# Altium schematic sheet matrix.SchDoc
size 1270 x 241 mm
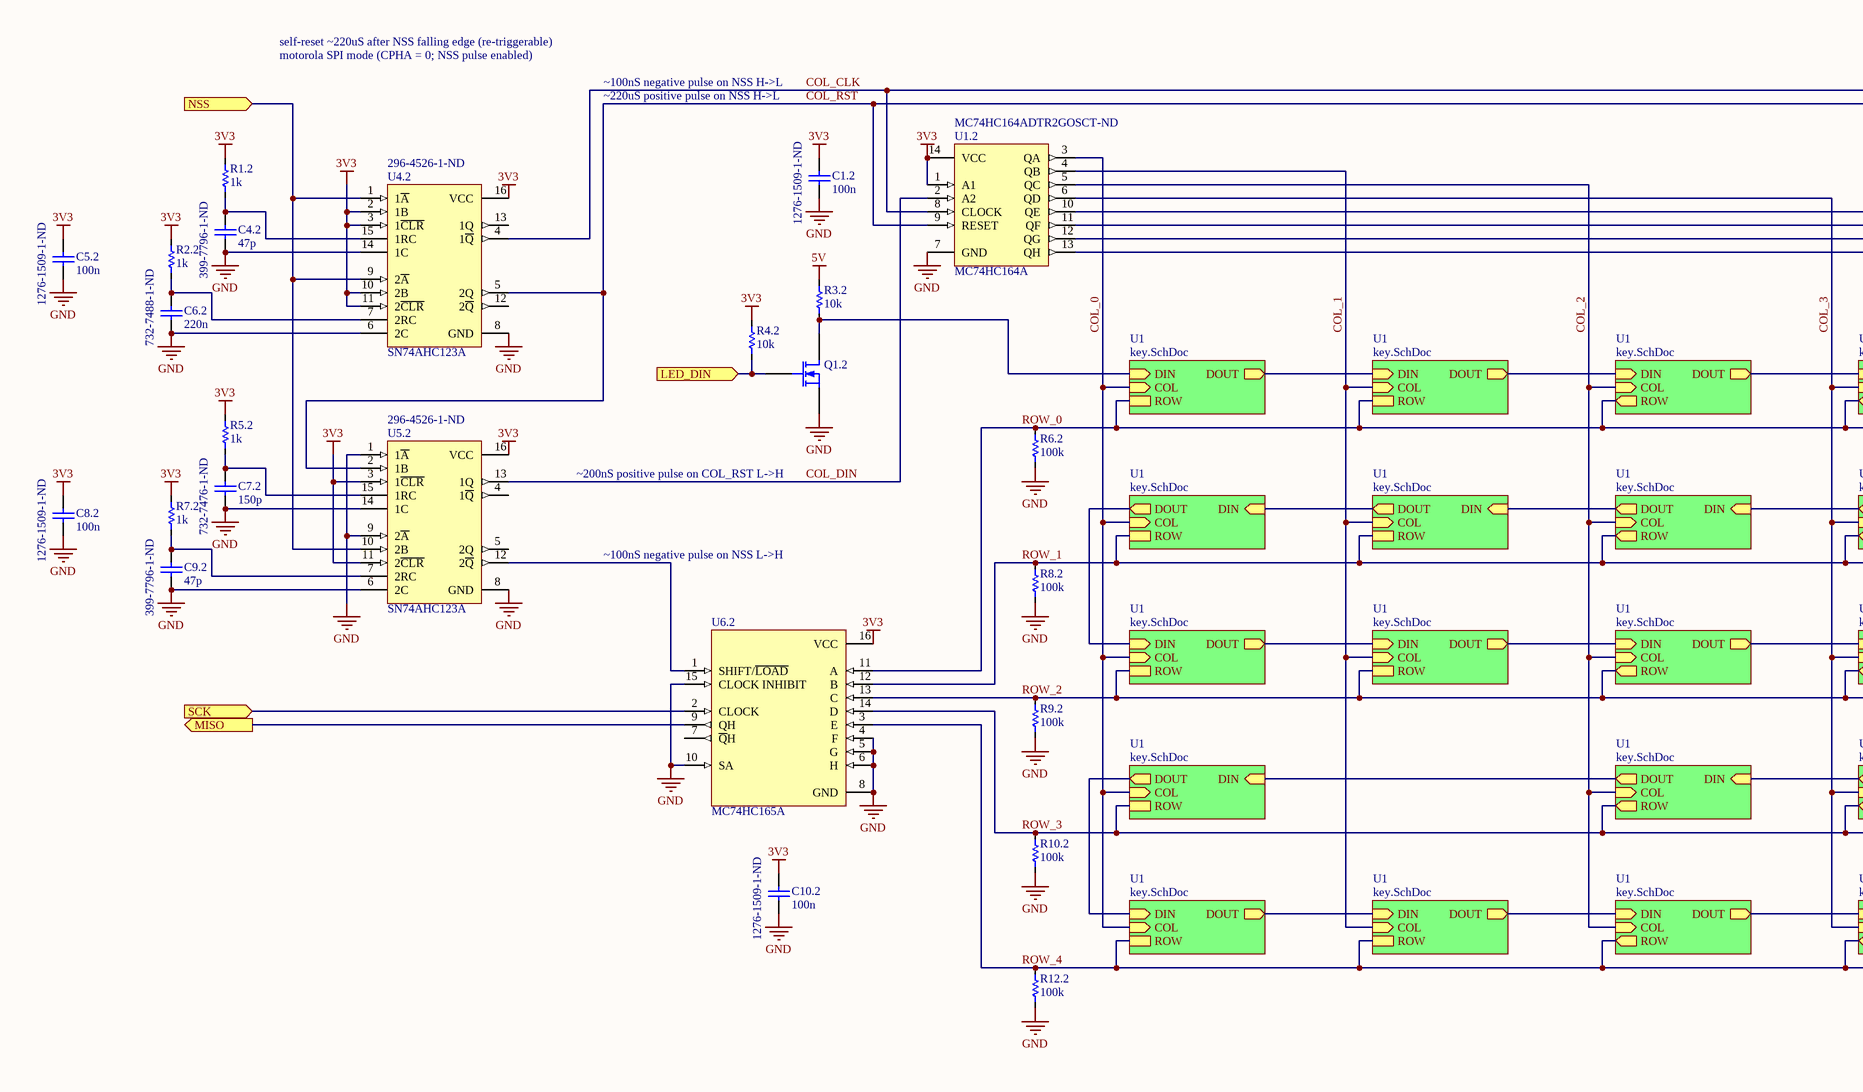
[diagram p0: matrix.SchDoc, left]
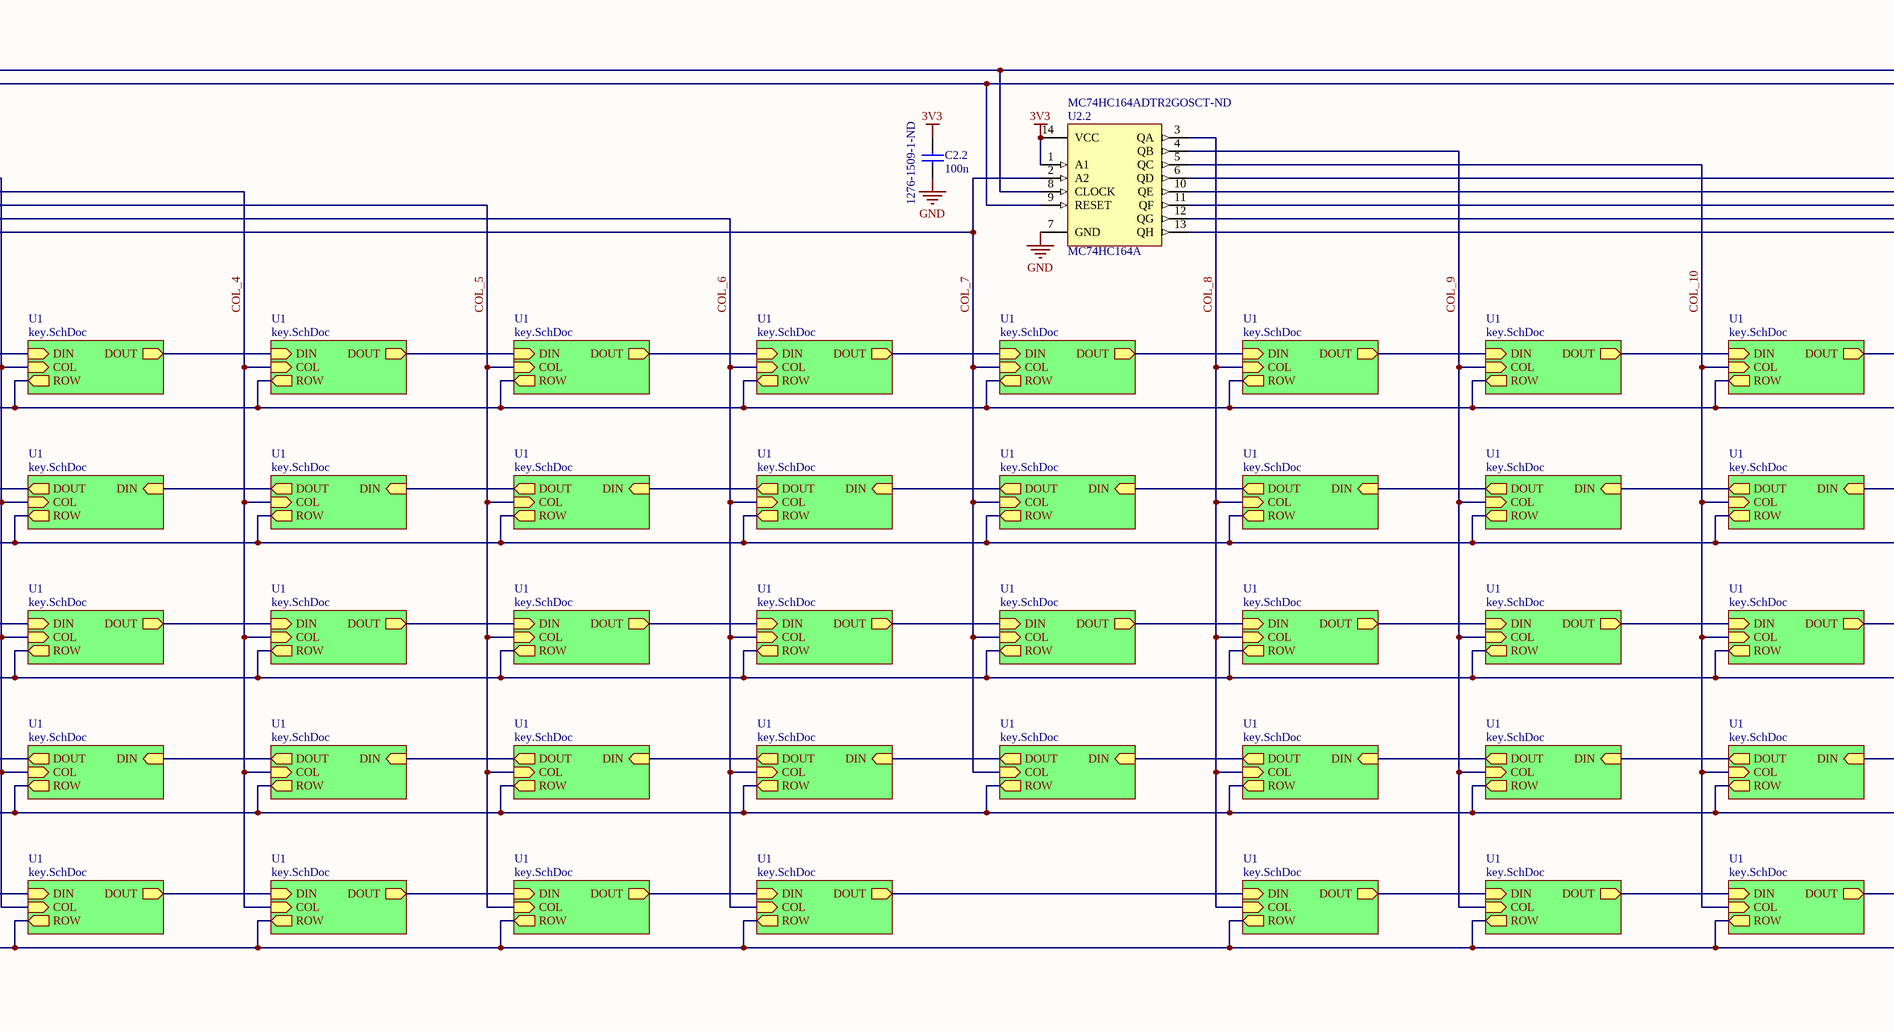
[diagram p1: matrix.SchDoc, middle]
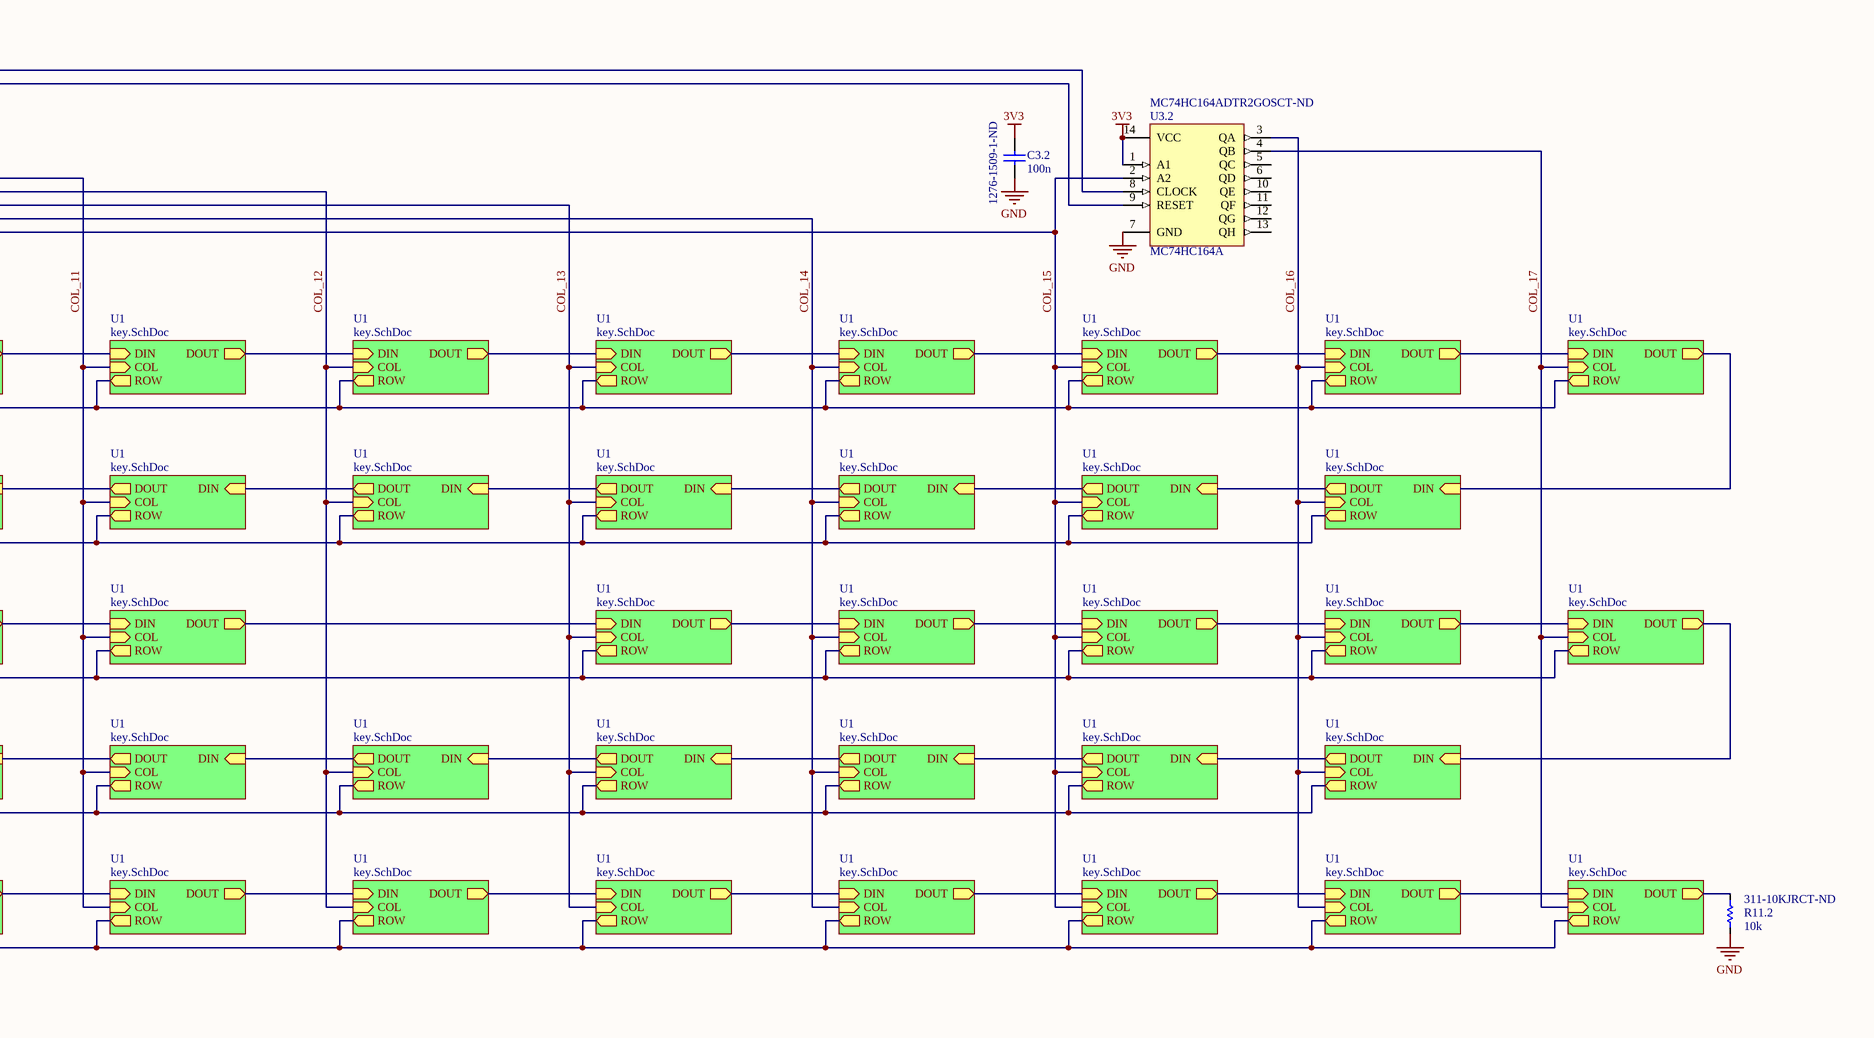
[diagram p2: matrix.SchDoc, right]

## Parts
C1.2  Supplier Part Number 1: 1276-1509-1-ND  [0402]  (hidden comment: 100n)
C2.2  Supplier Part Number 1: 1276-1509-1-ND  [0402]  (hidden comment: 100n)
C3.2  Supplier Part Number 1: 1276-1509-1-ND  [0402]  (hidden comment: 100n)
C4.2  Supplier Part Number 1: 399-7796-1-ND  [0402]  (hidden comment: 47p)
C5.2  Supplier Part Number 1: 1276-1509-1-ND  [0402]  (hidden comment: 100n)
C6.2  Supplier Part Number 1: 732-7488-1-ND  [0402]  (hidden comment: 220n)
C7.2  Supplier Part Number 1: 732-7476-1-ND  [0402]  (hidden comment: 150p)
C8.2  Supplier Part Number 1: 1276-1509-1-ND  [0402]  (hidden comment: 100n)
C9.2  Supplier Part Number 1: 399-7796-1-ND  [0402]  (hidden comment: 47p)
C10.2  Supplier Part Number 1: 1276-1509-1-ND  [0402]  (hidden comment: 100n)
Q1.2  2N7002  [SOT23]  (value not drawn)
R1.2  1k  [0402]
R2.2  1k  [0402]
R3.2  10k  [0402]
R4.2  10k  [0402]
R5.2  1k  [0402]
R6.2  100k  [0402]
R7.2  1k  [0402]
R8.2  100k  [0402]
R9.2  100k  [0402]
R10.2  100k  [0402]
R11.2  Supplier Part Number 1: 311-10KJRCT-ND  [0402]  (hidden comment: 10k)
R12.2  100k  [0402]
U1.2  MC74HC164A  Supplier Part Number 1: MC74HC164ADTR2GOSCT-ND  [TSOP65P640X120-14N]
U2.2  MC74HC164A  Supplier Part Number 1: MC74HC164ADTR2GOSCT-ND  [TSOP65P640X120-14N]
U3.2  MC74HC164A  Supplier Part Number 1: MC74HC164ADTR2GOSCT-ND  [TSOP65P640X120-14N]
U4.2  SN74AHC123A  Supplier Part Number 1: 296-4526-1-ND  [TSSOP16_N]
U5.2  SN74AHC123A  Supplier Part Number 1: 296-4526-1-ND  [TSSOP16_N]
U6.2  MC74HC165A  [TSSOP16_N]

## Sub-sheets
U1 = key.SchDoc: COL (in), ROW, DOUT (out), DIN (in)
U1 = key.SchDoc: COL (in), ROW, DOUT (out), DIN (in)
U1 = key.SchDoc: COL (in), ROW (out), DOUT (out), DIN (in)
U1 = key.SchDoc: COL (in), ROW (out), DOUT (out), DIN (in)
U1 = key.SchDoc: COL (in), ROW (out), DOUT (out), DIN (in)
U1 = key.SchDoc: COL (in), ROW (out), DOUT (out), DIN (in)
U1 = key.SchDoc: COL (in), ROW (out), DOUT (out), DIN (in)
U1 = key.SchDoc: COL (in), ROW (out), DOUT (out), DIN (in)
U1 = key.SchDoc: COL (in), ROW (out), DOUT (out), DIN (in)
U1 = key.SchDoc: COL (in), ROW (out), DOUT (out), DIN (in)
U1 = key.SchDoc: COL (in), ROW (out), DOUT (out), DIN (in)
U1 = key.SchDoc: COL (in), ROW (out), DOUT (out), DIN (in)
U1 = key.SchDoc: COL (in), ROW (out), DOUT (out), DIN (in)
U1 = key.SchDoc: COL (in), ROW (out), DOUT (out), DIN (in)
U1 = key.SchDoc: COL (in), ROW (out), DOUT (out), DIN (in)
U1 = key.SchDoc: COL (in), ROW (out), DOUT (out), DIN (in)
U1 = key.SchDoc: COL (in), ROW (out), DOUT (out), DIN (in)
U1 = key.SchDoc: COL (in), ROW (out), DOUT (out), DIN (in)
U1 = key.SchDoc: COL (in), ROW, DOUT (out), DIN (in)
U1 = key.SchDoc: COL (in), ROW, DOUT (out), DIN (in)
U1 = key.SchDoc: COL (in), ROW (out), DOUT (out), DIN (in)
U1 = key.SchDoc: COL (in), ROW (out), DOUT (out), DIN (in)
U1 = key.SchDoc: COL (in), ROW (out), DOUT (out), DIN (in)
U1 = key.SchDoc: COL (in), ROW (out), DOUT (out), DIN (in)
U1 = key.SchDoc: COL (in), ROW (out), DOUT (out), DIN (in)
U1 = key.SchDoc: COL (in), ROW (out), DOUT (out), DIN (in)
U1 = key.SchDoc: COL (in), ROW (out), DOUT (out), DIN (in)
U1 = key.SchDoc: COL (in), ROW (out), DOUT (out), DIN (in)
U1 = key.SchDoc: COL (in), ROW (out), DOUT (out), DIN (in)
U1 = key.SchDoc: COL (in), ROW (out), DOUT (out), DIN (in)
U1 = key.SchDoc: COL (in), ROW (out), DOUT (out), DIN (in)
U1 = key.SchDoc: COL (in), ROW (out), DOUT (out), DIN (in)
U1 = key.SchDoc: COL (in), ROW, DOUT (out), DIN (in)
U1 = key.SchDoc: COL (in), ROW, DOUT (out), DIN (in)
U1 = key.SchDoc: COL (in), ROW (out), DOUT (out), DIN (in)
U1 = key.SchDoc: COL (in), ROW (out), DOUT (out), DIN (in)
U1 = key.SchDoc: COL (in), ROW (out), DOUT (out), DIN (in)
U1 = key.SchDoc: COL (in), ROW (out), DOUT (out), DIN (in)
U1 = key.SchDoc: COL (in), ROW (out), DOUT (out), DIN (in)
U1 = key.SchDoc: COL (in), ROW (out), DOUT (out), DIN (in)
U1 = key.SchDoc: COL (in), ROW (out), DOUT (out), DIN (in)
U1 = key.SchDoc: COL (in), ROW (out), DOUT (out), DIN (in)
U1 = key.SchDoc: COL (in), ROW (out), DOUT (out), DIN (in)
U1 = key.SchDoc: COL (in), ROW (out), DOUT (out), DIN (in)
U1 = key.SchDoc: COL (in), ROW (out), DOUT (out), DIN (in)
U1 = key.SchDoc: COL (in), ROW, DOUT (out), DIN (in)
U1 = key.SchDoc: COL (in), ROW (out), DOUT (out), DIN (in)
U1 = key.SchDoc: COL (in), ROW (out), DOUT (out), DIN (in)
U1 = key.SchDoc: COL (in), ROW (out), DOUT (out), DIN (in)
U1 = key.SchDoc: COL (in), ROW (out), DOUT (out), DIN (in)
U1 = key.SchDoc: COL (in), ROW (out), DOUT (out), DIN (in)
U1 = key.SchDoc: COL (in), ROW (out), DOUT (out), DIN (in)
U1 = key.SchDoc: COL (in), ROW (out), DOUT (out), DIN (in)
U1 = key.SchDoc: COL (in), ROW (out), DOUT (out), DIN (in)
U1 = key.SchDoc: COL (in), ROW (out), DOUT (out), DIN (in)
U1 = key.SchDoc: COL (in), ROW (out), DOUT (out), DIN (in)
U1 = key.SchDoc: COL (in), ROW (out), DOUT (out), DIN (in)
U1 = key.SchDoc: COL (in), ROW, DOUT (out), DIN (in)
U1 = key.SchDoc: COL (in), ROW, DOUT (out), DIN (in)
U1 = key.SchDoc: COL (in), ROW (out), DOUT (out), DIN (in)
U1 = key.SchDoc: COL (in), ROW (out), DOUT (out), DIN (in)
U1 = key.SchDoc: COL (in), ROW (out), DOUT (out), DIN (in)
U1 = key.SchDoc: COL (in), ROW (out), DOUT (out), DIN (in)
U1 = key.SchDoc: COL (in), ROW (out), DOUT (out), DIN (in)
U1 = key.SchDoc: COL (in), ROW (out), DOUT (out), DIN (in)
U1 = key.SchDoc: COL (in), ROW (out), DOUT (out), DIN (in)
U1 = key.SchDoc: COL (in), ROW (out), DOUT (out), DIN (in)
U1 = key.SchDoc: COL (in), ROW (out), DOUT (out), DIN (in)
U1 = key.SchDoc: COL (in), ROW (out), DOUT (out), DIN (in)
U1 = key.SchDoc: COL (in), ROW (out), DOUT (out), DIN (in)
U1 = key.SchDoc: COL (in), ROW (out), DOUT (out), DIN (in)
U1 = key.SchDoc: COL (in), ROW (out), DOUT (out), DIN (in)
U1 = key.SchDoc: COL (in), ROW (out), DOUT (out), DIN (in)
U1 = key.SchDoc: COL (in), ROW (out), DOUT (out), DIN (in)
U1 = key.SchDoc: COL (in), ROW (out), DOUT (out), DIN (in)
U1 = key.SchDoc: COL (in), ROW (out), DOUT (out), DIN (in)
U1 = key.SchDoc: COL (in), ROW (out), DOUT (out), DIN (in)
U1 = key.SchDoc: COL (in), ROW (out), DOUT (out), DIN (in)
U1 = key.SchDoc: COL (in), ROW (out), DOUT (out), DIN (in)
U1 = key.SchDoc: COL (in), ROW (out), DOUT (out), DIN (in)
U1 = key.SchDoc: COL (in), ROW (out), DOUT (out), DIN (in)
U1 = key.SchDoc: COL (in), ROW (out), DOUT (out), DIN (in)
U1 = key.SchDoc: COL (in), ROW (out), DOUT (out), DIN (in)
U1 = key.SchDoc: COL (in), ROW (out), DOUT (out), DIN (in)
U1 = key.SchDoc: COL (in), ROW (out), DOUT (out), DIN (in)

## Ports
LED_DIN (in), MISO (out), NSS (in), SCK (in)

## Nets
3V3: C1.2.1 C2.2.1 C3.2.1 C5.2.1 C8.2.1 C10.2.1 R1.2.2 R2.2.2 R4.2.2 R5.2.2 R7.2.2 U1.2.1(A1) U1.2.14(VCC) U2.2.1(A1) U2.2.14(VCC) U3.2.1(A1) U3.2.14(VCC) U4.2.2(1B) U4.2.3(1~{CLR}) U4.2.10(2B) U4.2.11(2~{CLR}) U4.2.16(VCC) U5.2.3(1~{CLR}) U5.2.11(2~{CLR}) U5.2.16(VCC) U6.2.16(VCC)
5V: R3.2.2
GND: C1.2.2 C2.2.2 C3.2.2 C4.2.1 C5.2.2 C6.2.2 C7.2.1 C8.2.2 C9.2.1 C10.2.2 Q1.2.2(S) R6.2.1 R8.2.1 R9.2.1 R10.2.1 R11.2.1 R12.2.1 U1.2.7(GND) U2.2.7(GND) U3.2.7(GND) U4.2.6(2C) U4.2.8(GND) U4.2.14(1C) U5.2.1(1~{A}) U5.2.6(2C) U5.2.8(GND) U5.2.9(2~{A}) U5.2.14(1C) U6.2.4(F) U6.2.5(G) U6.2.6(H) U6.2.8(GND) U6.2.10(SA) U6.2.15(CLOCK_INHIBIT)
COL_0: U1.2.3(QA) ; sheet U1/COL, sheet U1/COL, sheet U1/COL, sheet U1/COL, sheet U1/COL
COL_1: U1.2.4(QB) ; sheet U1/COL, sheet U1/COL, sheet U1/COL, sheet U1/COL
COL_2: U1.2.5(QC) ; sheet U1/COL, sheet U1/COL, sheet U1/COL, sheet U1/COL, sheet U1/COL
COL_3: U1.2.6(QD) ; sheet U1/COL, sheet U1/COL, sheet U1/COL, sheet U1/COL, sheet U1/COL
COL_4: U1.2.10(QE) ; sheet U1/COL, sheet U1/COL, sheet U1/COL, sheet U1/COL, sheet U1/COL
COL_5: U1.2.11(QF) ; sheet U1/COL, sheet U1/COL, sheet U1/COL, sheet U1/COL, sheet U1/COL
COL_6: U1.2.12(QG) ; sheet U1/COL, sheet U1/COL, sheet U1/COL, sheet U1/COL, sheet U1/COL
COL_7: U1.2.13(QH) U2.2.2(A2) ; sheet U1/COL, sheet U1/COL, sheet U1/COL, sheet U1/COL
COL_8: U2.2.3(QA) ; sheet U1/COL, sheet U1/COL, sheet U1/COL, sheet U1/COL, sheet U1/COL
COL_9: U2.2.4(QB) ; sheet U1/COL, sheet U1/COL, sheet U1/COL, sheet U1/COL, sheet U1/COL
COL_10: U2.2.5(QC) ; sheet U1/COL, sheet U1/COL, sheet U1/COL, sheet U1/COL, sheet U1/COL
COL_11: U2.2.6(QD) ; sheet U1/COL, sheet U1/COL, sheet U1/COL, sheet U1/COL, sheet U1/COL
COL_12: U2.2.10(QE) ; sheet U1/COL, sheet U1/COL, sheet U1/COL, sheet U1/COL
COL_13: U2.2.11(QF) ; sheet U1/COL, sheet U1/COL, sheet U1/COL, sheet U1/COL, sheet U1/COL
COL_14: U2.2.12(QG) ; sheet U1/COL, sheet U1/COL, sheet U1/COL, sheet U1/COL, sheet U1/COL
COL_15: U2.2.13(QH) U3.2.2(A2) ; sheet U1/COL, sheet U1/COL, sheet U1/COL, sheet U1/COL, sheet U1/COL
COL_16: U3.2.3(QA) ; sheet U1/COL, sheet U1/COL, sheet U1/COL, sheet U1/COL, sheet U1/COL
COL_17: U3.2.4(QB) ; sheet U1/COL, sheet U1/COL, sheet U1/COL
COL_CLK: U1.2.8(CLOCK) U2.2.8(CLOCK) U3.2.8(CLOCK) U4.2.4(1~{Q})
COL_DIN: U1.2.2(A2) U5.2.13(1Q)
COL_RST: U1.2.9(RESET) U2.2.9(RESET) U3.2.9(RESET) U4.2.5(2Q) U5.2.2(1B)
LED_DIN: Q1.2.3(G) R4.2.1 ; port LED_DIN
MISO: U6.2.9(QH) ; port MISO
NSS: U4.2.1(1~{A}) U4.2.9(2~{A}) U5.2.10(2B) ; port NSS
ROW_0: R6.2.2 U6.2.11(A) ; sheet U1/ROW, sheet U1/ROW, sheet U1/ROW, sheet U1/ROW, sheet U1/ROW, sheet U1/ROW, sheet U1/ROW, sheet U1/ROW, sheet U1/ROW, sheet U1/ROW, sheet U1/ROW, sheet U1/ROW, sheet U1/ROW, sheet U1/ROW, sheet U1/ROW, sheet U1/ROW, sheet U1/ROW, sheet U1/ROW
ROW_1: R8.2.2 U6.2.12(B) ; sheet U1/ROW, sheet U1/ROW, sheet U1/ROW, sheet U1/ROW, sheet U1/ROW, sheet U1/ROW, sheet U1/ROW, sheet U1/ROW, sheet U1/ROW, sheet U1/ROW, sheet U1/ROW, sheet U1/ROW, sheet U1/ROW, sheet U1/ROW, sheet U1/ROW, sheet U1/ROW, sheet U1/ROW
ROW_2: R9.2.2 U6.2.13(C) ; sheet U1/ROW, sheet U1/ROW, sheet U1/ROW, sheet U1/ROW, sheet U1/ROW, sheet U1/ROW, sheet U1/ROW, sheet U1/ROW, sheet U1/ROW, sheet U1/ROW, sheet U1/ROW, sheet U1/ROW, sheet U1/ROW, sheet U1/ROW, sheet U1/ROW, sheet U1/ROW, sheet U1/ROW
ROW_3: R10.2.2 U6.2.14(D) ; sheet U1/ROW, sheet U1/ROW, sheet U1/ROW, sheet U1/ROW, sheet U1/ROW, sheet U1/ROW, sheet U1/ROW, sheet U1/ROW, sheet U1/ROW, sheet U1/ROW, sheet U1/ROW, sheet U1/ROW, sheet U1/ROW, sheet U1/ROW, sheet U1/ROW, sheet U1/ROW
ROW_4: R12.2.2 U6.2.3(E) ; sheet U1/ROW, sheet U1/ROW, sheet U1/ROW, sheet U1/ROW, sheet U1/ROW, sheet U1/ROW, sheet U1/ROW, sheet U1/ROW, sheet U1/ROW, sheet U1/ROW, sheet U1/ROW, sheet U1/ROW, sheet U1/ROW, sheet U1/ROW, sheet U1/ROW, sheet U1/ROW, sheet U1/ROW
SCK: U6.2.2(CLOCK) ; port SCK
NetC4.2_2: C4.2.2 R1.2.1 U4.2.15(1RC)
NetC6.2_1: C6.2.1 R2.2.1 U4.2.7(2RC)
NetC7.2_2: C7.2.2 R5.2.1 U5.2.15(1RC)
NetC9.2_2: C9.2.2 R7.2.1 U5.2.7(2RC)
NetQ1.2_1: Q1.2.1(D) R3.2.1 ; sheet U1/DIN
NetR11.2_2: R11.2.2 ; sheet U1/DOUT
NetU5.2_12: U5.2.12(2~{Q}) U6.2.1(SHIFT/~{LOAD})
(unnamed): sheet U1/DOUT, sheet U1/DIN
(unnamed): sheet U1/DOUT, sheet U1/DIN
(unnamed): sheet U1/DOUT, sheet U1/DIN
(unnamed): sheet U1/DOUT, sheet U1/DIN
(unnamed): sheet U1/DOUT, sheet U1/DIN
(unnamed): sheet U1/DOUT, sheet U1/DIN
(unnamed): sheet U1/DOUT, sheet U1/DIN
(unnamed): sheet U1/DOUT, sheet U1/DIN
(unnamed): sheet U1/DOUT, sheet U1/DIN
(unnamed): sheet U1/DOUT, sheet U1/DIN
(unnamed): sheet U1/DOUT, sheet U1/DIN
(unnamed): sheet U1/DOUT, sheet U1/DIN
(unnamed): sheet U1/DOUT, sheet U1/DIN
(unnamed): sheet U1/DOUT, sheet U1/DIN
(unnamed): sheet U1/DOUT, sheet U1/DIN
(unnamed): sheet U1/DOUT, sheet U1/DIN
(unnamed): sheet U1/DOUT, sheet U1/DIN
(unnamed): sheet U1/DOUT, sheet U1/DIN
(unnamed): sheet U1/DOUT, sheet U1/DIN
(unnamed): sheet U1/DIN, sheet U1/DOUT
(unnamed): sheet U1/DIN, sheet U1/DOUT
(unnamed): sheet U1/DIN, sheet U1/DOUT
(unnamed): sheet U1/DIN, sheet U1/DOUT
(unnamed): sheet U1/DIN, sheet U1/DOUT
(unnamed): sheet U1/DIN, sheet U1/DOUT
(unnamed): sheet U1/DIN, sheet U1/DOUT
(unnamed): sheet U1/DIN, sheet U1/DOUT
(unnamed): sheet U1/DIN, sheet U1/DOUT
(unnamed): sheet U1/DIN, sheet U1/DOUT
(unnamed): sheet U1/DIN, sheet U1/DOUT
(unnamed): sheet U1/DIN, sheet U1/DOUT
(unnamed): sheet U1/DIN, sheet U1/DOUT
(unnamed): sheet U1/DIN, sheet U1/DOUT
(unnamed): sheet U1/DOUT, sheet U1/DIN
(unnamed): sheet U1/DOUT, sheet U1/DIN
(unnamed): sheet U1/DOUT, sheet U1/DIN
(unnamed): sheet U1/DOUT, sheet U1/DIN
(unnamed): sheet U1/DOUT, sheet U1/DIN
(unnamed): sheet U1/DOUT, sheet U1/DIN
(unnamed): sheet U1/DOUT, sheet U1/DIN
(unnamed): sheet U1/DOUT, sheet U1/DIN
(unnamed): sheet U1/DOUT, sheet U1/DIN
(unnamed): sheet U1/DOUT, sheet U1/DIN
(unnamed): sheet U1/DOUT, sheet U1/DIN
(unnamed): sheet U1/DOUT, sheet U1/DIN
(unnamed): sheet U1/DOUT, sheet U1/DIN
(unnamed): sheet U1/DOUT, sheet U1/DIN
(unnamed): sheet U1/DIN, sheet U1/DOUT
(unnamed): sheet U1/DIN, sheet U1/DOUT
(unnamed): sheet U1/DIN, sheet U1/DOUT
(unnamed): sheet U1/DIN, sheet U1/DOUT
(unnamed): sheet U1/DIN, sheet U1/DOUT
(unnamed): sheet U1/DIN, sheet U1/DOUT
(unnamed): sheet U1/DIN, sheet U1/DOUT
(unnamed): sheet U1/DIN, sheet U1/DOUT
(unnamed): sheet U1/DIN, sheet U1/DOUT
(unnamed): sheet U1/DIN, sheet U1/DOUT
(unnamed): sheet U1/DIN, sheet U1/DOUT
(unnamed): sheet U1/DIN, sheet U1/DOUT
(unnamed): sheet U1/DOUT, sheet U1/DIN
(unnamed): sheet U1/DOUT, sheet U1/DIN
(unnamed): sheet U1/DOUT, sheet U1/DIN
(unnamed): sheet U1/DOUT, sheet U1/DIN
(unnamed): sheet U1/DOUT, sheet U1/DIN
(unnamed): sheet U1/DOUT, sheet U1/DIN
(unnamed): sheet U1/DOUT, sheet U1/DIN
(unnamed): sheet U1/DOUT, sheet U1/DIN
(unnamed): sheet U1/DOUT, sheet U1/DIN
(unnamed): sheet U1/DOUT, sheet U1/DIN
(unnamed): sheet U1/DOUT, sheet U1/DIN
(unnamed): sheet U1/DOUT, sheet U1/DIN
(unnamed): sheet U1/DOUT, sheet U1/DIN
(unnamed): sheet U1/DOUT, sheet U1/DIN
(unnamed): sheet U1/DIN, sheet U1/DOUT
(unnamed): sheet U1/DIN, sheet U1/DOUT
(unnamed): sheet U1/DIN, sheet U1/DOUT
(unnamed): sheet U1/DOUT, sheet U1/DIN
(unnamed): sheet U1/DOUT, sheet U1/DIN
(unnamed): sheet U1/DOUT, sheet U1/DIN
(unnamed): sheet U1/DOUT, sheet U1/DIN
(unnamed): sheet U1/DIN, sheet U1/DOUT
(unnamed): sheet U1/DIN, sheet U1/DOUT
(unnamed): sheet U1/DOUT, sheet U1/DIN
(unnamed): sheet U1/DOUT, sheet U1/DIN

Not connected (* = marked no-connect by the designer): U3.2 5(QC) 6(QD) 10(QE) 11(QF) 12(QG) 13(QH); U4.2 12(2~{Q}) 13(1Q); U5.2 4(1~{Q}) 5(2Q); U6.2 7(~{Q}H)

## Notes on the sheet
- self-reset ~220uS after NSS falling edge (re-triggerable)
- motorola SPI mode (CPHA = 0; NSS pulse enabled)
- ~100nS negative pulse on NSS H->L
- ~220uS positive pulse on NSS H->L
- ~200nS positive pulse on COL_RST L->H
- ~100nS negative pulse on NSS L->H

## Library data of the parts
C1.2 C2.2 C3.2 C4.2 C5.2 C6.2 C7.2 C8.2 C9.2 C10.2 = CAPACITOR NON_POL: Supplier 1: Digi-Key
  C1.2 C2.2 C3.2 C5.2 C8.2 C10.2: Value: 100n
  C4.2 C9.2: Value: 47p
  C6.2: Value: 220n
  C7.2: Value: 150p
Q1.2 = 2N7002: N-Channel Enhancement Mode Vertical DMOS FET; Supplier 1: Digi-Key; Supplier Part Number 1: 2N7002-TPMSCT-ND
R1.2 R2.2 R3.2 R4.2 R5.2 R6.2 R7.2 R8.2 R9.2 R10.2 R11.2 R12.2 = RESISTOR: Supplier 1: Digi-Key
  R1.2 R2.2 R5.2 R7.2: Value: 1k; Supplier Part Number 1: A106129CT-ND
  R3.2 R4.2: Value: 10k; Supplier Part Number 1: 311-10KJRCT-ND
  R6.2 R8.2 R9.2 R10.2 R12.2: Value: 100k; Supplier Part Number 1: RMCF0402JT100KCT-ND
  R11.2: Value: 10k
U1.2 U2.2 U3.2 = MC74HC164A: IC SHIFT REGISTER 8BIT; Supplier 1: Digi-Key
U4.2 U5.2 = SN74AHC123A: IC DUAL RETRIG MULTIVIB; Supplier 1: Digi-Key
U6.2 = MC74HC165A: IC SHIFT REGISTER IN 8BIT